# EAGLE design nes_mini (EAGLE 6.4)
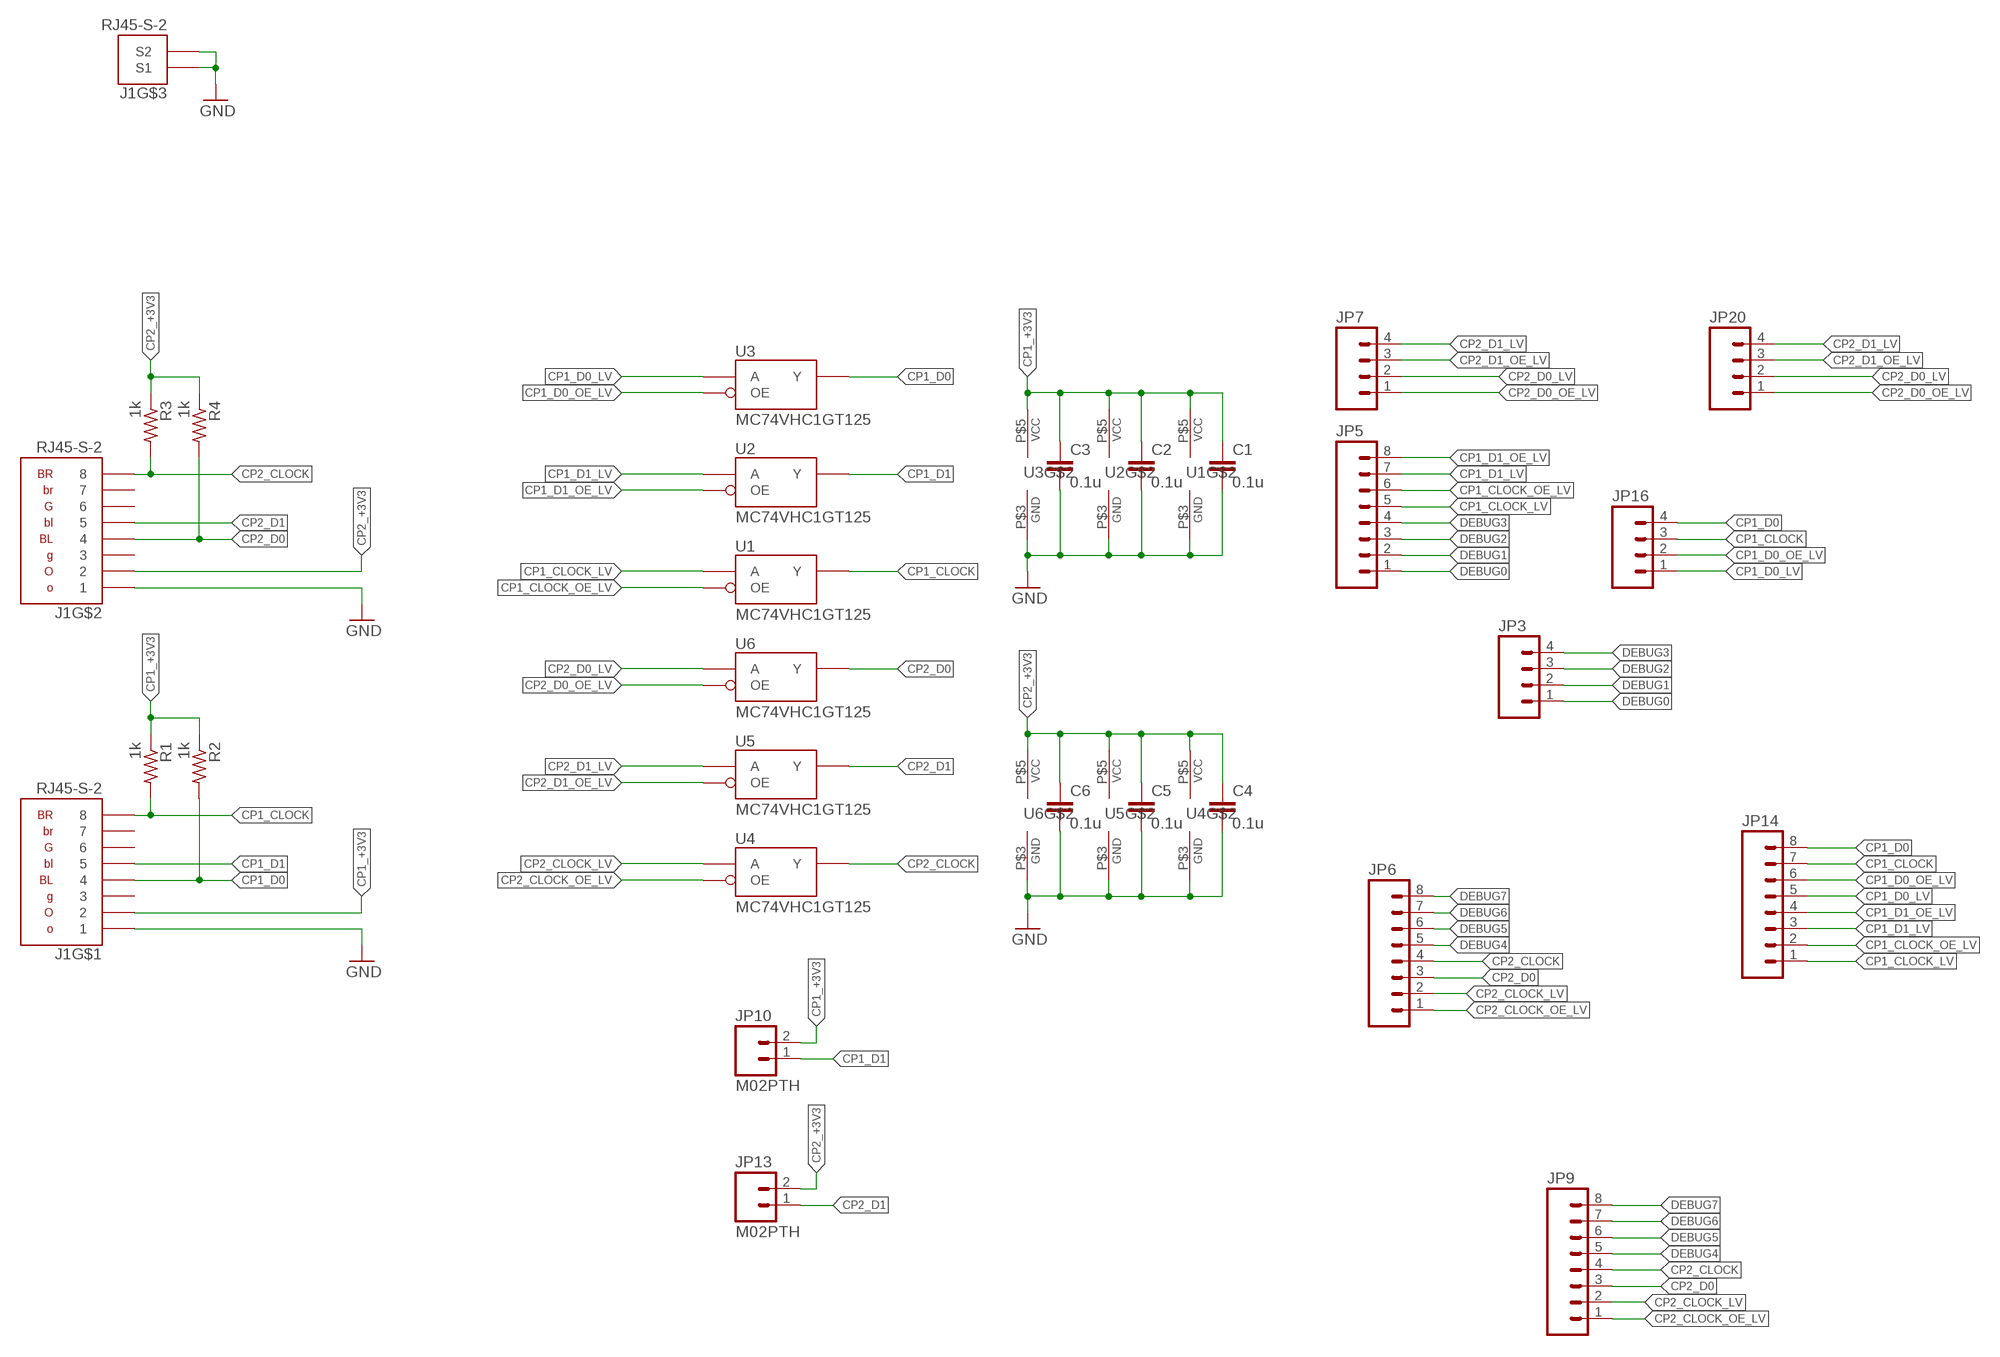
[diagram p0: schematic, sheet 1, part 1 of 2]
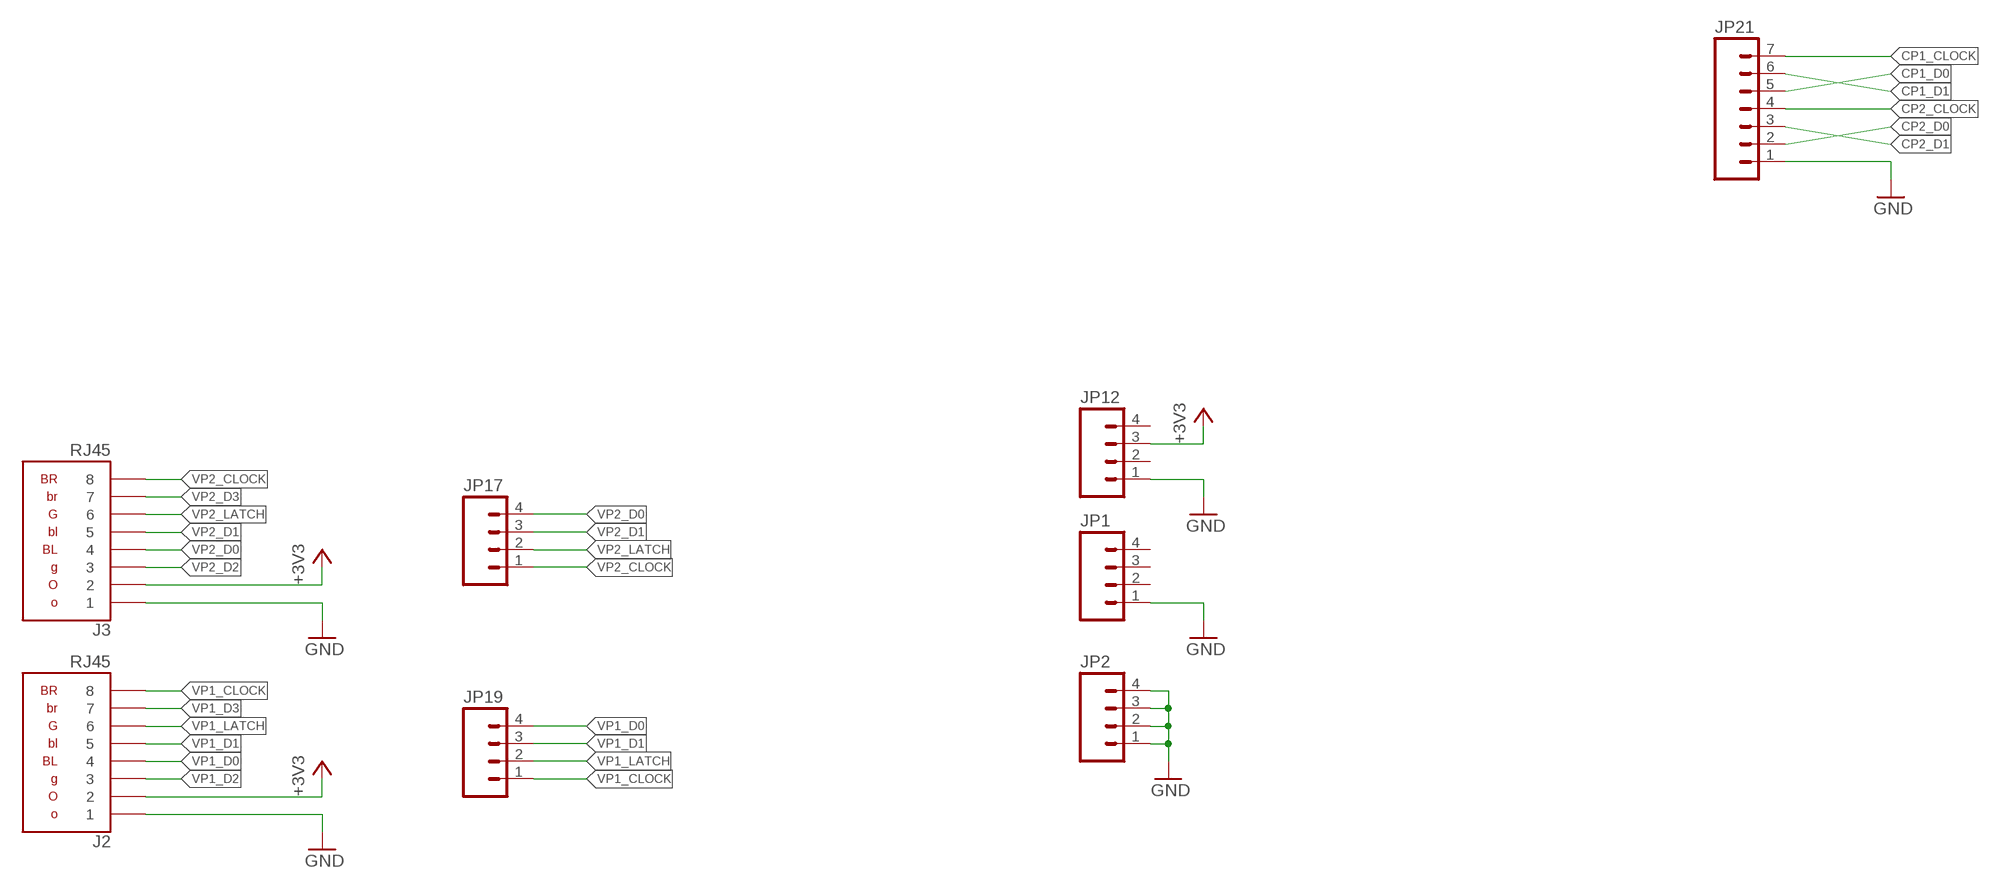
[diagram p1: schematic, sheet 1, part 2 of 2]

## Parts
C1  0.1u  C-EUC0603  [C0603]
C2  0.1u  C-EUC0603  [C0603]
C3  0.1u  C-EUC0603  [C0603]
C4  0.1u  C-EUC0603  [C0603]
C5  0.1u  C-EUC0603  [C0603]
C6  0.1u  C-EUC0603  [C0603]
J1  RJ45-S-2  [RJ45-S-2]
J2  RJ45  [RJ45]
J3  RJ45  [RJ45]
JP1  M04PTH  [1X04]
JP2  M04PTH  [1X04]
JP3  M04PTH  [1X04]
JP5  M081X08  [1X08]
JP6  M081X08  [1X08]
JP7  M04PTH  [1X04]
JP9  M081X08  [1X08]
JP10  M02PTH  [1X02]
JP12  M04PTH  [1X04]
JP13  M02PTH  [1X02]
JP14  M081X08  [1X08]
JP16  M04PTH  [1X04]
JP17  M04PTH  [1X04]
JP19  M04PTH  [1X04]
JP20  M04PTH  [1X04]
JP21  M07  [1X07]
R1  1k  R-US_0207/2V  [0207/2V]
R2  1k  R-US_0207/2V  [0207/2V]
R3  1k  R-US_0207/2V  [0207/2V]
R4  1k  R-US_0207/2V  [0207/2V]
U1  MC74VHC1GT125  [TSOP-5]
U2  MC74VHC1GT125  [TSOP-5]
U3  MC74VHC1GT125  [TSOP-5]
U4  MC74VHC1GT125  [TSOP-5]
U5  MC74VHC1GT125  [TSOP-5]
U6  MC74VHC1GT125  [TSOP-5]

## Nets
+3V3: J2.2 J3.2 JP12.3
CP1_+3V3: C1.1 C2.1 C3.1 J1.1-2 JP10.2 R1.1 R2.1 U1.P$5(VCC) U2.P$5(VCC) U3.P$5(VCC)
CP1_CLOCK: J1.1-8 JP14.7 JP16.3 JP21.7 R1.2 U1.P$4(Y)
CP1_CLOCK_LV: JP5.5 JP14.1 U1.P$2(A)
CP1_CLOCK_OE_LV: JP5.6 JP14.2 U1.P$1(OE)
CP1_D0: J1.1-4 JP14.8 JP16.4 JP21.5 R2.2 U3.P$4(Y)
CP1_D0_LV: JP14.5 JP16.1 U3.P$2(A)
CP1_D0_OE_LV: JP14.6 JP16.2 U3.P$1(OE)
CP1_D1: J1.1-5 JP10.1 JP21.6 U2.P$4(Y)
CP1_D1_LV: JP5.7 JP14.3 U2.P$2(A)
CP1_D1_OE_LV: JP5.8 JP14.4 U2.P$1(OE)
CP2_+3V3: C4.1 C5.1 C6.1 J1.2-2 JP13.2 R3.1 R4.1 U4.P$5(VCC) U5.P$5(VCC) U6.P$5(VCC)
CP2_CLOCK: J1.2-8 JP6.4 JP9.4 JP21.4 R3.2 U4.P$4(Y)
CP2_CLOCK_LV: JP6.2 JP9.2 U4.P$2(A)
CP2_CLOCK_OE_LV: JP6.1 JP9.1 U4.P$1(OE)
CP2_D0: J1.2-4 JP6.3 JP9.3 JP21.2 R4.2 U6.P$4(Y)
CP2_D0_LV: JP7.2 JP20.2 U6.P$2(A)
CP2_D0_OE_LV: JP7.1 JP20.1 U6.P$1(OE)
CP2_D1: J1.2-5 JP13.1 JP21.3 U5.P$4(Y)
CP2_D1_LV: JP7.4 JP20.4 U5.P$2(A)
CP2_D1_OE_LV: JP7.3 JP20.3 U5.P$1(OE)
DEBUG0: JP3.1 JP5.1
DEBUG1: JP3.2 JP5.2
DEBUG2: JP3.3 JP5.3
DEBUG3: JP3.4 JP5.4
DEBUG4: JP6.5 JP9.5
DEBUG5: JP6.6 JP9.6
DEBUG6: JP6.7 JP9.7
DEBUG7: JP6.8 JP9.8
GND: C1.2 C2.2 C3.2 C4.2 C5.2 C6.2 J1.1-1 J1.2-1 J1.S1 J1.S2 J2.1 J3.1 JP1.1 JP2.1 JP2.2 JP2.3 JP2.4 JP12.1 JP21.1 U1.P$3(GND) U2.P$3(GND) U3.P$3(GND) U4.P$3(GND) U5.P$3(GND) U6.P$3(GND)
VP1_CLOCK: J2.8 JP19.1
VP1_D0: J2.4 JP19.4
VP1_D1: J2.5 JP19.3
VP1_D2: J2.3
VP1_D3: J2.7
VP1_LATCH: J2.6 JP19.2
VP2_CLOCK: J3.8 JP17.1
VP2_D0: J3.4 JP17.4
VP2_D1: J3.5 JP17.3
VP2_D2: J3.3
VP2_D3: J3.7
VP2_LATCH: J3.6 JP17.2
Unconnected: J1.1-3 J1.1-6 J1.1-7 J1.2-3 J1.2-6 J1.2-7 JP1.2 JP1.3 JP1.4 JP12.2 JP12.4

## Library data of the parts
C1-C6 = rcl:C-EU: CAPACITOR, European symbol
J1 = TASLink:RJ45-S-2
J2 J3 = TASLink:RJ45
JP1-JP3 JP7 JP12 JP16 JP17 JP19 JP20 = SparkFun-Connectors:M04: Header 4 Standard 4-pin 0.1" header. Use with straight break away headers (SKU : PRT-00116), right angle break away headers (PRT-00553), swiss pins (PRT-00743), machine pins (PRT-00117), and female headers (PRT-00115). Molex polarized connector foot print use with SKU : PRT-08231 with associated crimp pins and housings. 1MM SMD Version SKU: PRT-10208
JP5 JP6 JP9 JP14 = SparkFun-Connectors:M08: Header 8 Standard 8-pin 0.1" header. Use with straight break away headers (SKU : PRT-00116), right angle break away headers (PRT-00553), swiss pins (PRT-00743), machine pins (PRT-00117), and female headers (PRT-00115).
JP10 JP13 = SparkFun-Connectors:M02: Standard 2-pin 0.1" header. Use with - straight break away headers ( PRT-00116) - right angle break away headers (PRT-00553) - swiss pins (PRT-00743) - machine pins (PRT-00117) - female headers (PRT-00115) Molex polarized connector foot print use with: PRT-08233 with associated crimp pins and housings. 2.54_SCREWTERM for use with PRT-10571. 3.5mm Screw Terminal footprints for PRT-08084 5mm Screw Terminal footprints for use with PRT-08433
JP21 = SparkFun-Connectors:M07: Header 7 Standard 7-pin 0.1" header. Use with straight break away headers (SKU : PRT-00116), right angle break away headers (PRT-00553), swiss pins (PRT-00743), machine pins (PRT-00117), and female headers (PRT-00115). NOTES ON THE VARIANTS LOCK and LOCK_LONGPADS... This footprint was designed to help hold the alignment of a through-hole component (i.e. 7-pin header) while soldering it into place. You may notice that each hole has been shifted either up or down by 0.005 of an inch from it's more standard position (which is usually a perfectly straight line). This slight alteration caused the pins (the squares in the middle) to touch the edges of the holes. Because they are alternating, it causes a "brace" to hold the header in place. 0.005 has proven to be the perfect amount of "off-center" position when using our standard breakaway headers. Although looks a little odd when you look at the bare footprint, once you have a header in there, the alteration is very hard to notice. Also, if you push a header all the way into place, it is covered up entirely on the bottom side. This idea of altering the position of holes to aid alignment will be further integrated into the Sparkfun Library for other footprints. It can help hold any component with 3 or more connection pins.
R1-R4 = rcl:R-US_: RESISTOR, American symbol
U1-U6 = TASLink:MC74VHC1GT125

## Board
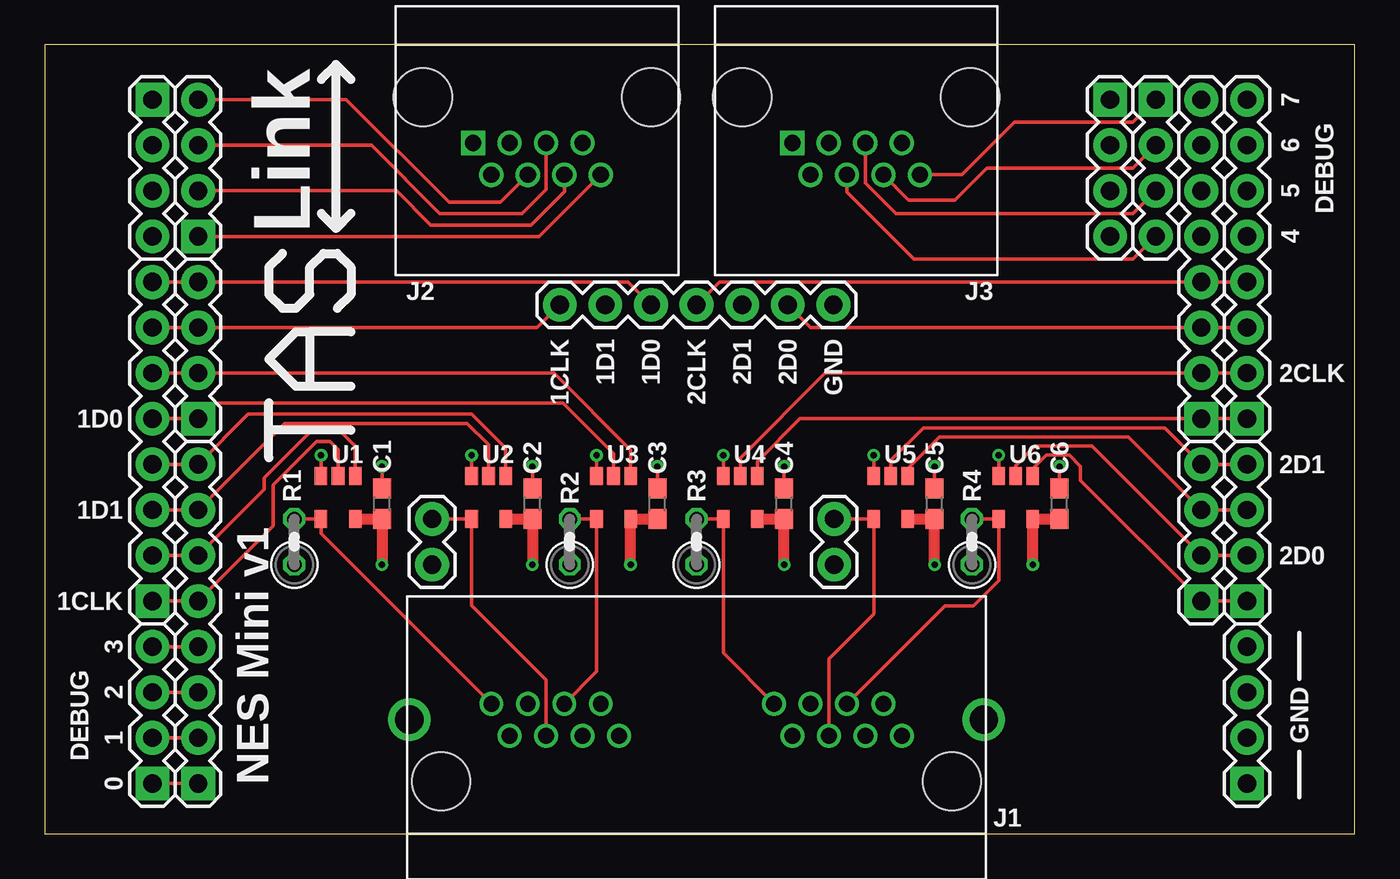
[diagram p2: board, top side]
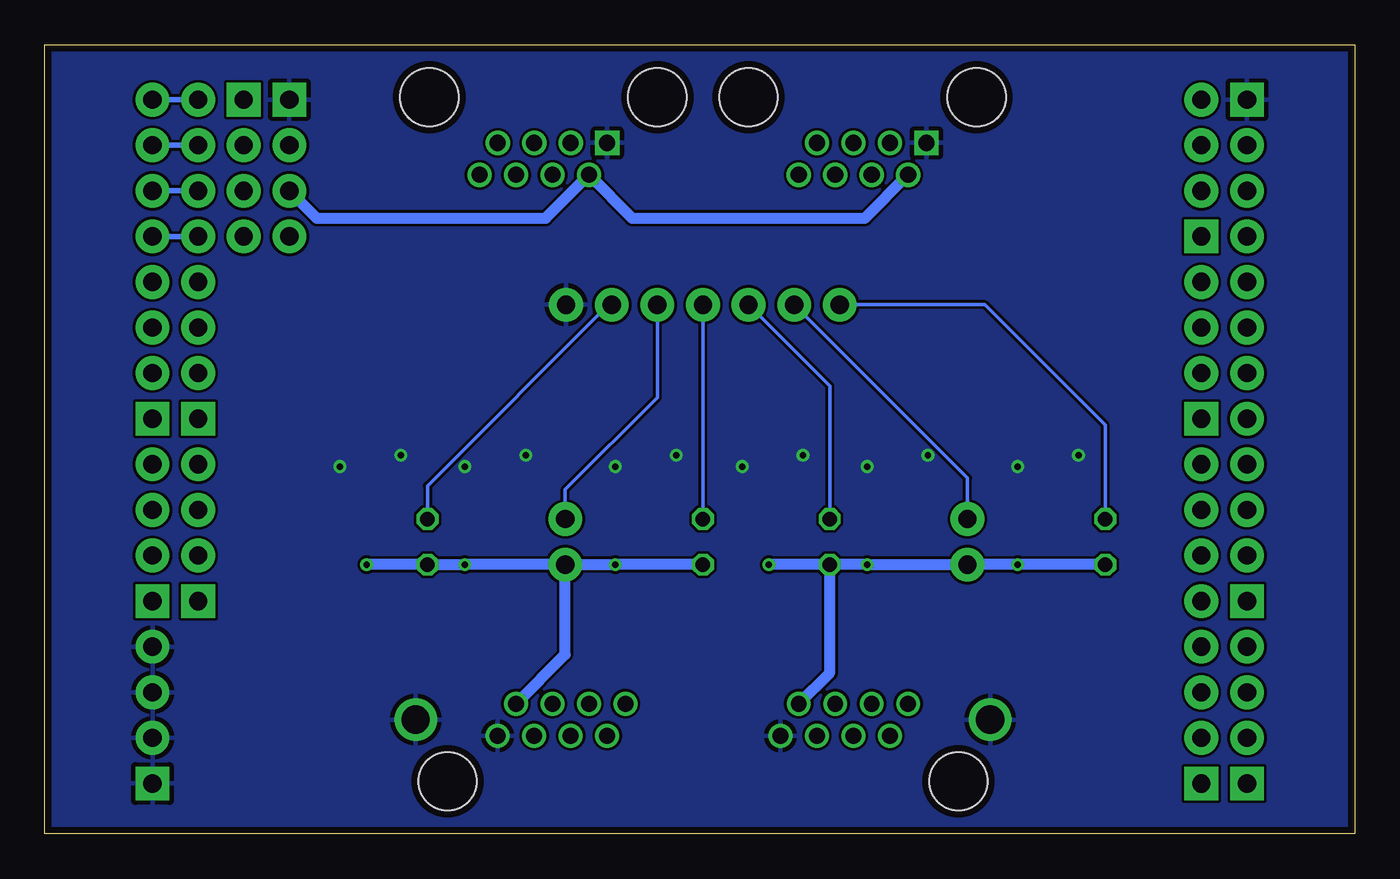
[diagram p3: board, bottom side, seen from below]

Size 72.95 x 43.94 mm. Coordinates in mm from the lower left corner, seen from the top.
Outline: 0,0 72.95,0 72.95,43.94 0,43.94 0,0
Copper layers (1*16): Top 0.0356mm / dielectric 1.5011mm / Bottom 0.0356mm
Design rules "LaenPCBOrder *": minimum track width 6mil, minimum drill 13mil, track to track 6mil, track to pad 6mil, pad to pad 6mil, via to via 6mil, smd to smd 6mil, copper to edge 15mil, drill to drill 6mil, minimum pad ring 7mil, minimum via ring 7mil, stop-mask expansion 3mil, vias tented up to drill 15mil, thermal gap 10mil

### Footprints (pad centres in the part's own frame; a part is rotated, then mirrored left to right if it is on the bottom)
C0603 = smd 1.1 x 1: 1 -0.85,0; 2 0.85,0
RJ45-S-2 = drill 0.889: 1-1 -4.318,-1.27; 1-2 -5.334,0.508; 1-3 -6.35,-1.27; 1-4 -7.366,0.508; 1-5 -8.382,-1.27; 1-6 -9.398,0.508; 1-7 -10.414,-1.27; 1-8 -11.43,0.508; 2-1 11.43,-1.27; 2-2 10.414,0.508; 2-3 9.398,-1.27; 2-4 8.382,0.508; 2-5 7.366,-1.27; 2-6 6.35,0.508; 2-7 5.334,-1.27; 2-8 4.318,0.508 | drill 1.575: S1 16.002,-0.381; S2 -16.002,-0.381 | hole 3.251: -14.224,-3.81; 14.224,-3.81
RJ45 = drill 0.9 square: 1 3.556,-0.889 | drill 0.9: 2 2.54,0.889; 3 1.524,-0.889; 4 0.508,0.889; 5 -0.508,-0.889; 6 -1.524,0.889; 7 -2.54,-0.889; 8 -3.556,0.889 | hole 3.251: -6.35,-3.429; 6.35,-3.429
1X04 = drill 1.016 pad 1.88 square: 1 0,0 | drill 1.016 pad 1.88: 2 2.54,0; 3 5.08,0; 4 7.62,0
1X08 = drill 1.016 pad 1.88 square: 1 0,0 | drill 1.016 pad 1.88: 2 2.54,0; 3 5.08,0; 4 7.62,0; 5 10.16,0; 6 12.7,0; 7 15.24,0; 8 17.78,0
1X02 = drill 1.016 pad 1.88: 1 0,0; 2 2.54,0
1X07 = drill 1.016 pad 1.88: 1 0,0; 2 2.54,0; 3 5.08,0; 4 7.62,0; 5 10.16,0; 6 12.7,0; 7 15.24,0
0207/2V = drill 0.813 octagon: 1 -1.27,0; 2 1.27,0
TSOP-5 = smd 0.7 x 1: P$1 0.95,1.2; P$2 0,1.2; P$3 -0.95,1.2; P$4 -0.95,-1.2; P$5 0.95,-1.2

### Placement (x,y rotation side)
C1  18.77,18.38 90 top
C2  27.15,18.38 90 top
C3  34.11,18.38 90 top
C4  41.17,18.38 90 top
C5  49.56,18.38 90 top
C6  56.52,18.38 90 top
J1  36.3,6.73 0 top
J2  27.41,37.59 180 top
J3  45.19,37.59 180 top
JP1  5.99,40.89 270 top
JP2  66.95,2.79 90 top
JP3  5.99,2.79 90 top
JP5  8.53,2.79 90 top
JP6  64.41,23.11 90 top
JP7  64.41,12.95 90 top
JP9  66.95,23.11 90 top
JP10  21.56,17.53 270 top
JP12  59.33,40.89 270 top
JP13  43.97,17.53 270 top
JP14  5.99,12.95 90 top
JP16  8.53,23.11 90 top
JP17  61.87,40.89 270 top
JP19  8.53,33.27 90 top
JP20  66.95,12.95 90 top
JP21  43.92,29.46 180 top
R1  13.89,16.26 90 top
R2  29.24,16.26 90 top
R3  36.3,16.26 90 top
R4  51.64,16.26 90 top
U1  16.33,18.73 0 top
U2  24.71,18.73 0 top
U3  31.67,18.73 0 top
U4  38.73,18.73 0 top
U5  47.12,18.73 0 top
U6  54.08,18.73 0 top

### Tracks (layer width: path | path; a pad name or v marks a point on that pad's centre or on a via)
+3V3
  Bottom 0.61: JP12.3 57.81,34.29 45.06,34.29 J3.2 40.23,34.29 27.28,34.29 J2.2
CP1_+3V3  (via drill 0.36)
  Top 0.61: v18.77,14.99 C1.1 U1.P$5 | v27.15,14.99 C2.1 U2.P$5 | v32.62,14.99 U3.P$5 C3.1
  Bottom 0.61: R1.1 v18.77,14.99 JP10.2 v27.15,14.99 R2.1 | R2.1 v32.62,14.99 | J1.1-2 29.24,8.97 R2.1
CP1_CLOCK
  Top 0.203: J1.1-8 15.38,16.72 U1.P$4 R1.2 | JP14.7 JP16.3 27.41,28.19 JP21.7
  Bottom 0.203: R1.2 13.89,22.76 20.6,29.46 JP21.7
CP1_CLOCK_LV
  Top 0.203: U1.P$2 16.33,21.41 15.9,21.84 15.14,21.84 12.73,19.43 12.73,17.14 JP5.5 JP14.1
CP1_CLOCK_OE_LV
  Top 0.203: U1.P$1 17.28,21.61 16.54,22.35 14.76,22.35 12.22,19.81 12.22,19.18 JP5.6 JP14.2
CP1_D0
  Top 0.203: R2.2 U3.P$4 30.72,9.03 J1.1-4 | JP21.5 32.49,30.73 JP16.4 JP14.8
  Bottom 0.203: R2.2 29.24,24.94 JP21.5
CP1_D0_LV
  Top 0.203: U3.P$2 31.67,21.18 28.85,24 9.42,24 JP16.1 JP14.5
CP1_D0_OE_LV
  Top 0.203: U3.P$1 32.62,21.38 28.35,25.65 JP16.2 JP14.6
CP1_D1
  Top 0.203: J1.1-5 27.91,8.56 23.76,12.71 U2.P$4 JP10.1
  Bottom 0.203: JP10.1 21.56,19.81 JP21.6
CP1_D1_LV
  Top 0.203: U2.P$2 24.71,21.67 23.52,22.86 13.36,22.86 JP5.7 JP14.3
CP1_D1_OE_LV
  Top 0.203: U2.P$1 25.66,21.48 23.77,23.37 11.33,23.37 JP5.8 JP14.4
CP2_+3V3  (via drill 0.36)
  Top 0.61: v41.17,14.99 C4.1 U4.P$5 | v49.56,14.99 C5.1 U5.P$5 | v55.03,14.99 U6.P$5 C6.1
  Bottom 0.61: R3.1 v41.17,14.99 JP13.2 | JP13.2 v49.56,14.99 R4.1 v55.03,14.99 | J1.2-2 43.97,9.98 JP13.2
CP2_CLOCK
  Top 0.203: J1.2-8 37.79,10.07 U4.P$4 R3.2 | JP21.4 37.57,30.73 JP6.4 JP9.4
  Bottom 0.203: R3.2 JP21.4
CP2_CLOCK_LV
  Top 0.203: U4.P$2 38.74,20.93 43.46,25.65 JP6.2 JP9.2
CP2_CLOCK_OE_LV
  Top 0.203: U4.P$1 39.69,20.74 42.06,23.11 JP6.1 JP9.1
CP2_D0
  Top 0.203: J1.2-4 50.14,12.7 51.71,12.7 53.13,14.11 U6.P$4 R4.2 | JP21.2 42.65,28.19 JP6.3 JP9.3
  Bottom 0.203: R4.2 51.64,19.38 41.55,29.46 JP21.2
CP2_D0_LV
  Top 0.203: U6.P$2 54.08,20.52 55.14,21.59 58.32,21.59 JP7.2 JP20.2
CP2_D0_OE_LV
  Top 0.203: U6.P$1 55.03,20.33 55.78,21.08 57.05,21.08 57.68,20.45 57.68,19.68 JP7.1 JP20.1
CP2_D1
  Top 0.203: J1.2-5 43.66,9.73 46.17,12.23 U5.P$4 JP13.1
  Bottom 0.203: JP13.1 43.97,19.18 38.84,24.31 JP21.3
CP2_D1_LV
  Top 0.203: U5.P$2 47.12,20.8 48.92,22.61 62.38,22.61 JP7.4 JP20.4
CP2_D1_OE_LV
  Top 0.203: U5.P$1 48.07,20.36 49.81,22.1 60.35,22.1 JP7.3 JP20.3
DEBUG0
  Top 0.203: JP5.1 JP3.1
DEBUG1
  Top 0.203: JP3.2 JP5.2
DEBUG2
  Top 0.203: JP5.3 JP3.3
DEBUG3
  Top 0.203: JP3.4 JP5.4
DEBUG4
  Bottom 0.305: JP9.5 JP6.5
DEBUG5
  Bottom 0.305: JP6.6 JP9.6
DEBUG6
  Bottom 0.305: JP9.7 JP6.7
DEBUG7
  Bottom 0.305: JP6.8 JP9.8
GND  (via drill 0.36)
  Top 0.203: U2.P$3 v23.76,21.08 | U1.P$3 v15.38,21.08 | U3.P$3 v30.72,21.08 | U4.P$3 v37.79,21.08 | U5.P$3 v46.17,21.08 | U6.P$3 v53.13,21.08 | C1.2 v18.77,20.45 | C2.2 v27.15,20.45 | C3.2 v34.11,20.45 | C4.2 v41.17,20.45 | C5.2 v49.56,20.45 | C6.2 v56.52,20.45
  pour Bottom: 0,43.94 72.95,43.94 72.95,0 0,0
VP1_CLOCK
  Top 0.203: JP19.1 27.53,33.27 J2.8
VP1_D0
  Top 0.203: JP19.4 16.79,40.89 22.5,35.18 25.37,35.18 J2.4
VP1_D1
  Top 0.203: JP19.3 18.19,38.35 22,34.54 26.57,34.54 27.91,35.89 J2.5
VP1_LATCH
  Top 0.203: JP19.2 19.58,35.81 21.49,33.91 27.08,33.91 28.93,35.76 J2.6
VP2_CLOCK
  Top 0.203: J3.8 51.08,36.7 54,39.62 60.6,39.62 JP17.1
VP2_D0
  Top 0.203: J3.4 44.68,35.74 48.41,32 60.6,32 JP17.4
VP2_D1
  Top 0.203: J3.5 45.69,36.25 47.4,34.54 60.6,34.54 JP17.3
VP2_LATCH
  Top 0.203: J3.6 48.11,35.31 50.7,35.31 52.48,37.08 60.6,37.08 JP17.2

### Text on the board
tPlace: 7 | 6 | DEBUG | 5 | Link | 4 | 1CLK | 1D1 | 1D0 | 2CLK | 2D1 | 2D0 | GND | 2CLK | 1D0 | 2D1 | 1D1 | 2D0 | 1CLK | 3 | NES Mini v1 | 2 | DEBUG | GND | 1 | 0